# Altium schematic sheet ARRAY-5050.SchDoc
size A; SheetNumber: 1; SheetTotal: 1
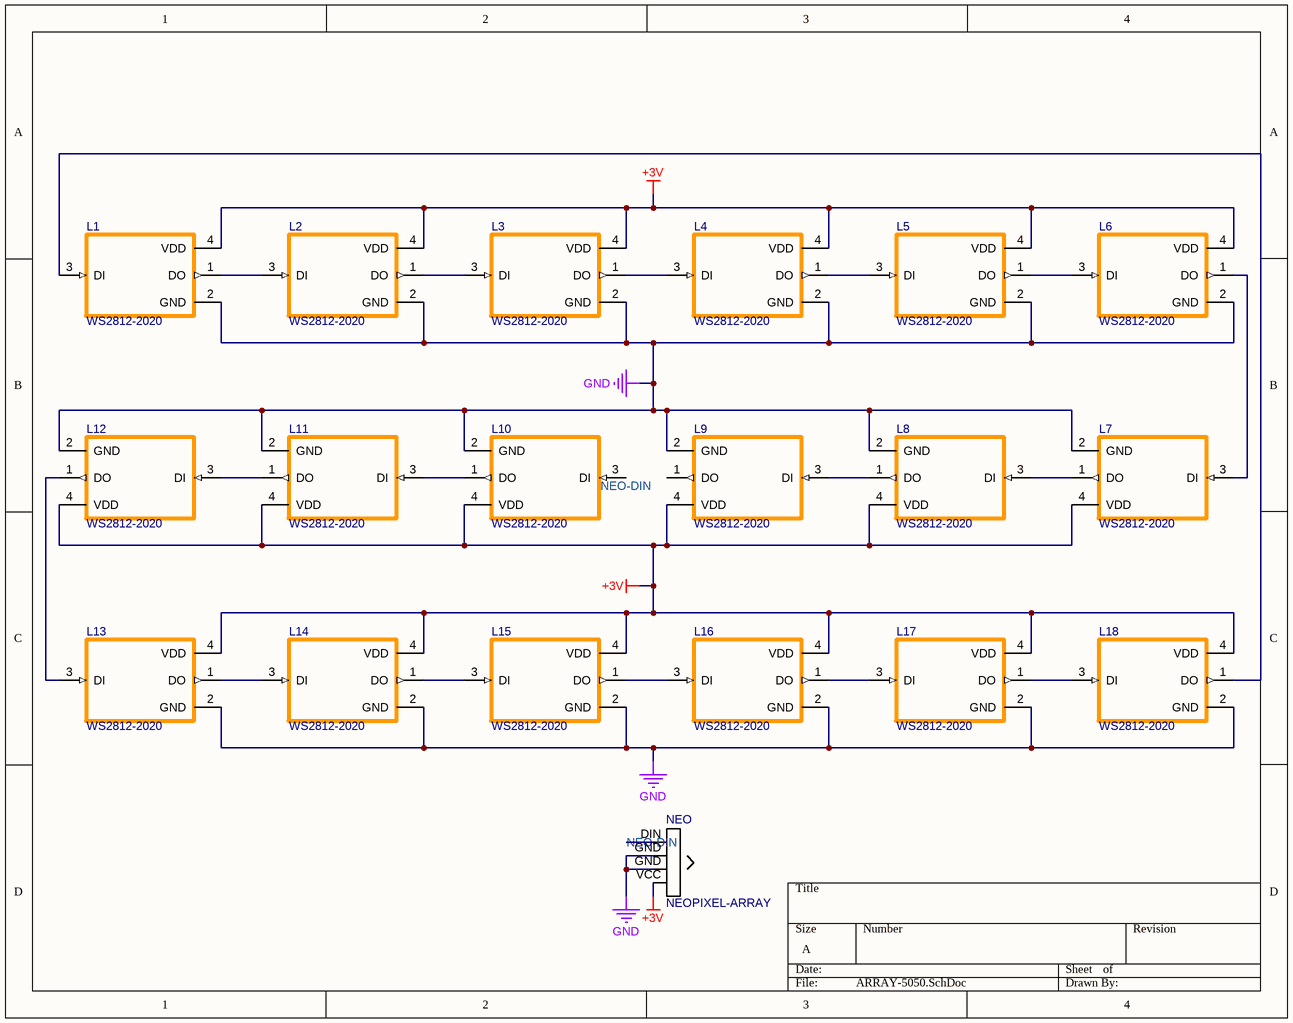
[diagram p0: ARRAY-5050.SchDoc]

## Parts
L1  WS2812-2020  [NEOPIXEL-5050]
L2  WS2812-2020  [NEOPIXEL-5050]
L3  WS2812-2020  [NEOPIXEL-5050]
L4  WS2812-2020  [NEOPIXEL-5050]
L5  WS2812-2020  [NEOPIXEL-5050]
L6  WS2812-2020  [NEOPIXEL-5050]
L7  WS2812-2020  [NEOPIXEL-5050]
L8  WS2812-2020  [NEOPIXEL-5050]
L9  WS2812-2020  [NEOPIXEL-5050]
L10  WS2812-2020  [NEOPIXEL-5050]
L11  WS2812-2020  [NEOPIXEL-5050]
L12  WS2812-2020  [NEOPIXEL-5050]
L13  WS2812-2020  [NEOPIXEL-5050]
L14  WS2812-2020  [NEOPIXEL-5050]
L15  WS2812-2020  [NEOPIXEL-5050]
L16  WS2812-2020  [NEOPIXEL-5050]
L17  WS2812-2020  [NEOPIXEL-5050]
L18  WS2812-2020  [NEOPIXEL-5050]
NEO  NEOPIXEL-ARRAY  [NEOPIXEL-ARRAY]

## Nets
+3V: L1.4(VDD) L2.4(VDD) L3.4(VDD) L4.4(VDD) L5.4(VDD) L6.4(VDD) L7.4(VDD) L8.4(VDD) L9.4(VDD) L10.4(VDD) L11.4(VDD) L12.4(VDD) L13.4(VDD) L14.4(VDD) L15.4(VDD) L16.4(VDD) L17.4(VDD) L18.4(VDD) NEO.VCC
GND: L1.2(GND) L2.2(GND) L3.2(GND) L4.2(GND) L5.2(GND) L6.2(GND) L7.2(GND) L8.2(GND) L9.2(GND) L10.2(GND) L11.2(GND) L12.2(GND) L13.2(GND) L14.2(GND) L15.2(GND) L16.2(GND) L17.2(GND) L18.2(GND) NEO.GND
NEO-DIN: L10.3(DI) NEO.DIN
NetL1_1: L1.1(DO) L2.3(DI)
NetL1_3: L1.3(DI) L18.1(DO)
NetL2_1: L2.1(DO) L3.3(DI)
NetL3_1: L3.1(DO) L4.3(DI)
NetL4_1: L4.1(DO) L5.3(DI)
NetL5_1: L5.1(DO) L6.3(DI)
NetL6_1: L6.1(DO) L7.3(DI)
NetL7_1: L7.1(DO) L8.3(DI)
NetL8_1: L8.1(DO) L9.3(DI)
NetL10_1: L10.1(DO) L11.3(DI)
NetL11_1: L11.1(DO) L12.3(DI)
NetL12_1: L12.1(DO) L13.3(DI)
NetL13_1: L13.1(DO) L14.3(DI)
NetL14_1: L14.1(DO) L15.3(DI)
NetL15_1: L15.1(DO) L16.3(DI)
NetL16_1: L16.1(DO) L17.3(DI)
NetL17_1: L17.1(DO) L18.3(DI)

Not connected (* = marked no-connect by the designer): L9 1(DO)

## Library data of the parts
L1-L18 = NEOPIXEL-5050